# Altium project JacdacConnectorOnly 75.PrjPCB
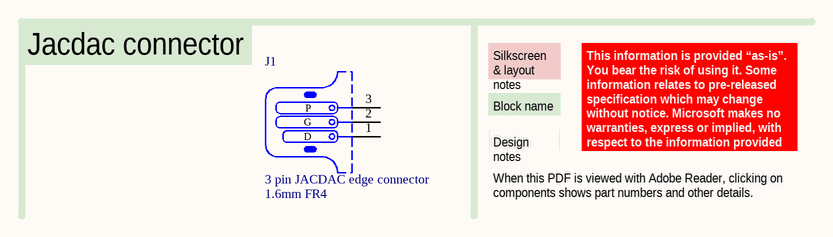
[diagram p0: JacdacConnectorOnly 75.SchDoc]
ProjectRevision: 0.2; ProjectLicenceTerms: Attribution 4.0 International (CC BY 4.0); ProjectDrawnBy: SH; ProjectCodenameID: 75; ProjectCodenameDescription: Tiny PCB with just a Jacdac connector; ProjectCodeName: JacdacConnectorOnly
1 sheet, 1 parts. Net scope: global (net labels, ports and power ports of the same name join across sheets).
Board file: JacdacConnectorOnly 75.PcbDoc

## Sheet JacdacConnectorOnly 75.SchDoc: Complete design
size A4; DrawnBy: SH; DocumentNumber: 1; Revision: 0.2; SheetNumber: 1; SheetTotal: 1; VersionControl_RevNumber: 1

### Parts
J1  3 pin JACDAC edge connector  PCB Type: 1.6mm FR4  [JACDAC_EDGE_CONNECTOR_0.2mm_T&G]

### Nets

Not connected (* = marked no-connect by the designer): J1 1(D) 2(G) 3(P)

### Notes on the sheet
- Jacdac connector
- Block name
- Silkscreen & layout notes
- Design notes
- When this PDF is viewed with Adobe Reader, clicking on components shows part numbers and other details.
- This information is provided “as-is”. You bear the risk of using it. Some information relates to pre-released specification which may change without notice. Microsoft makes no warranties, express or implied, with respect to the information provided here.
- PROJECT FILENAME
- PROJECT CODENAME
- Microsoft
- PROJECT DESCRIPTION
- SHEET DESCRIPTION
- SHEET FILENAME
- LICENCE
- LAST MODIFIED
- PAGE
- OF
- DRAWN BY
- REVISION
- PCB ID

### Library data of the parts
J1 = Jacdac edge connector: 3 pin Jacdac edge connector 1.27mm pitch; Manufacturer Part Number: JACDAC_EDGE_CONNECTOR; Checked By: ?; Created By: D. Gakure; ComponentLink1Description: Yuliang JACDAC cable connector drawing online; ComponentLink1URL: https://github.com/microsoft/jacdac-mdk/blob/main/connector/JACDAC-Connector-by-Yuliang-2020-11-28.pdf; ComponentLink2Description: JACDAC PCB edge connector spec onlin; ComponentLink2URL: https://github.com/microsoft/jacdac-mdk/blob/main/connector/JACDAC_PCB_Edge_Connector_Drawing_JD-PEC-01_rev_01.pdf